# Altium schematic sheet SIG_IN.SchDoc
size A4; Organization: Altium Limited; Address1: L3, 12a Rodborough Rd; Address2: Frenchs Forest; Address3: NSW; Address4: Australia 2086
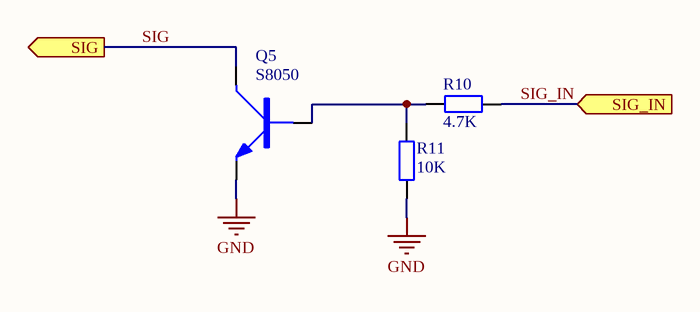
[diagram p0: SIG_IN.SchDoc]

## Parts
Q5  S8050  [SOT-23]
R10  4.7K  [R 0603]
R11  10K  [R 0603]

## Ports
SIG (out), SIG_IN (in)

## Nets
GND: Q5.E R11.1
SIG: Q5.C ; port SIG
SIG_IN: R10.2 ; port SIG_IN
NetQ5_B: Q5.B R10.1 R11.2

## Notes on the sheet
- Title
- Size:
- Date:
- A4
- Number:
- Time:
- Revision:
- Sheet
- of
- File:

## Library data of the parts
Q5 = NPN: NPN三极管
R10 R11 = R: 贴片电阻; 版权归属: 源创客; BOM名称: 贴片电阻; 学习资源: www.ooocke.com